# EAGLE design AQ_sensor_GSM (EAGLE 9.6.2)

## Sheet 1 of 2
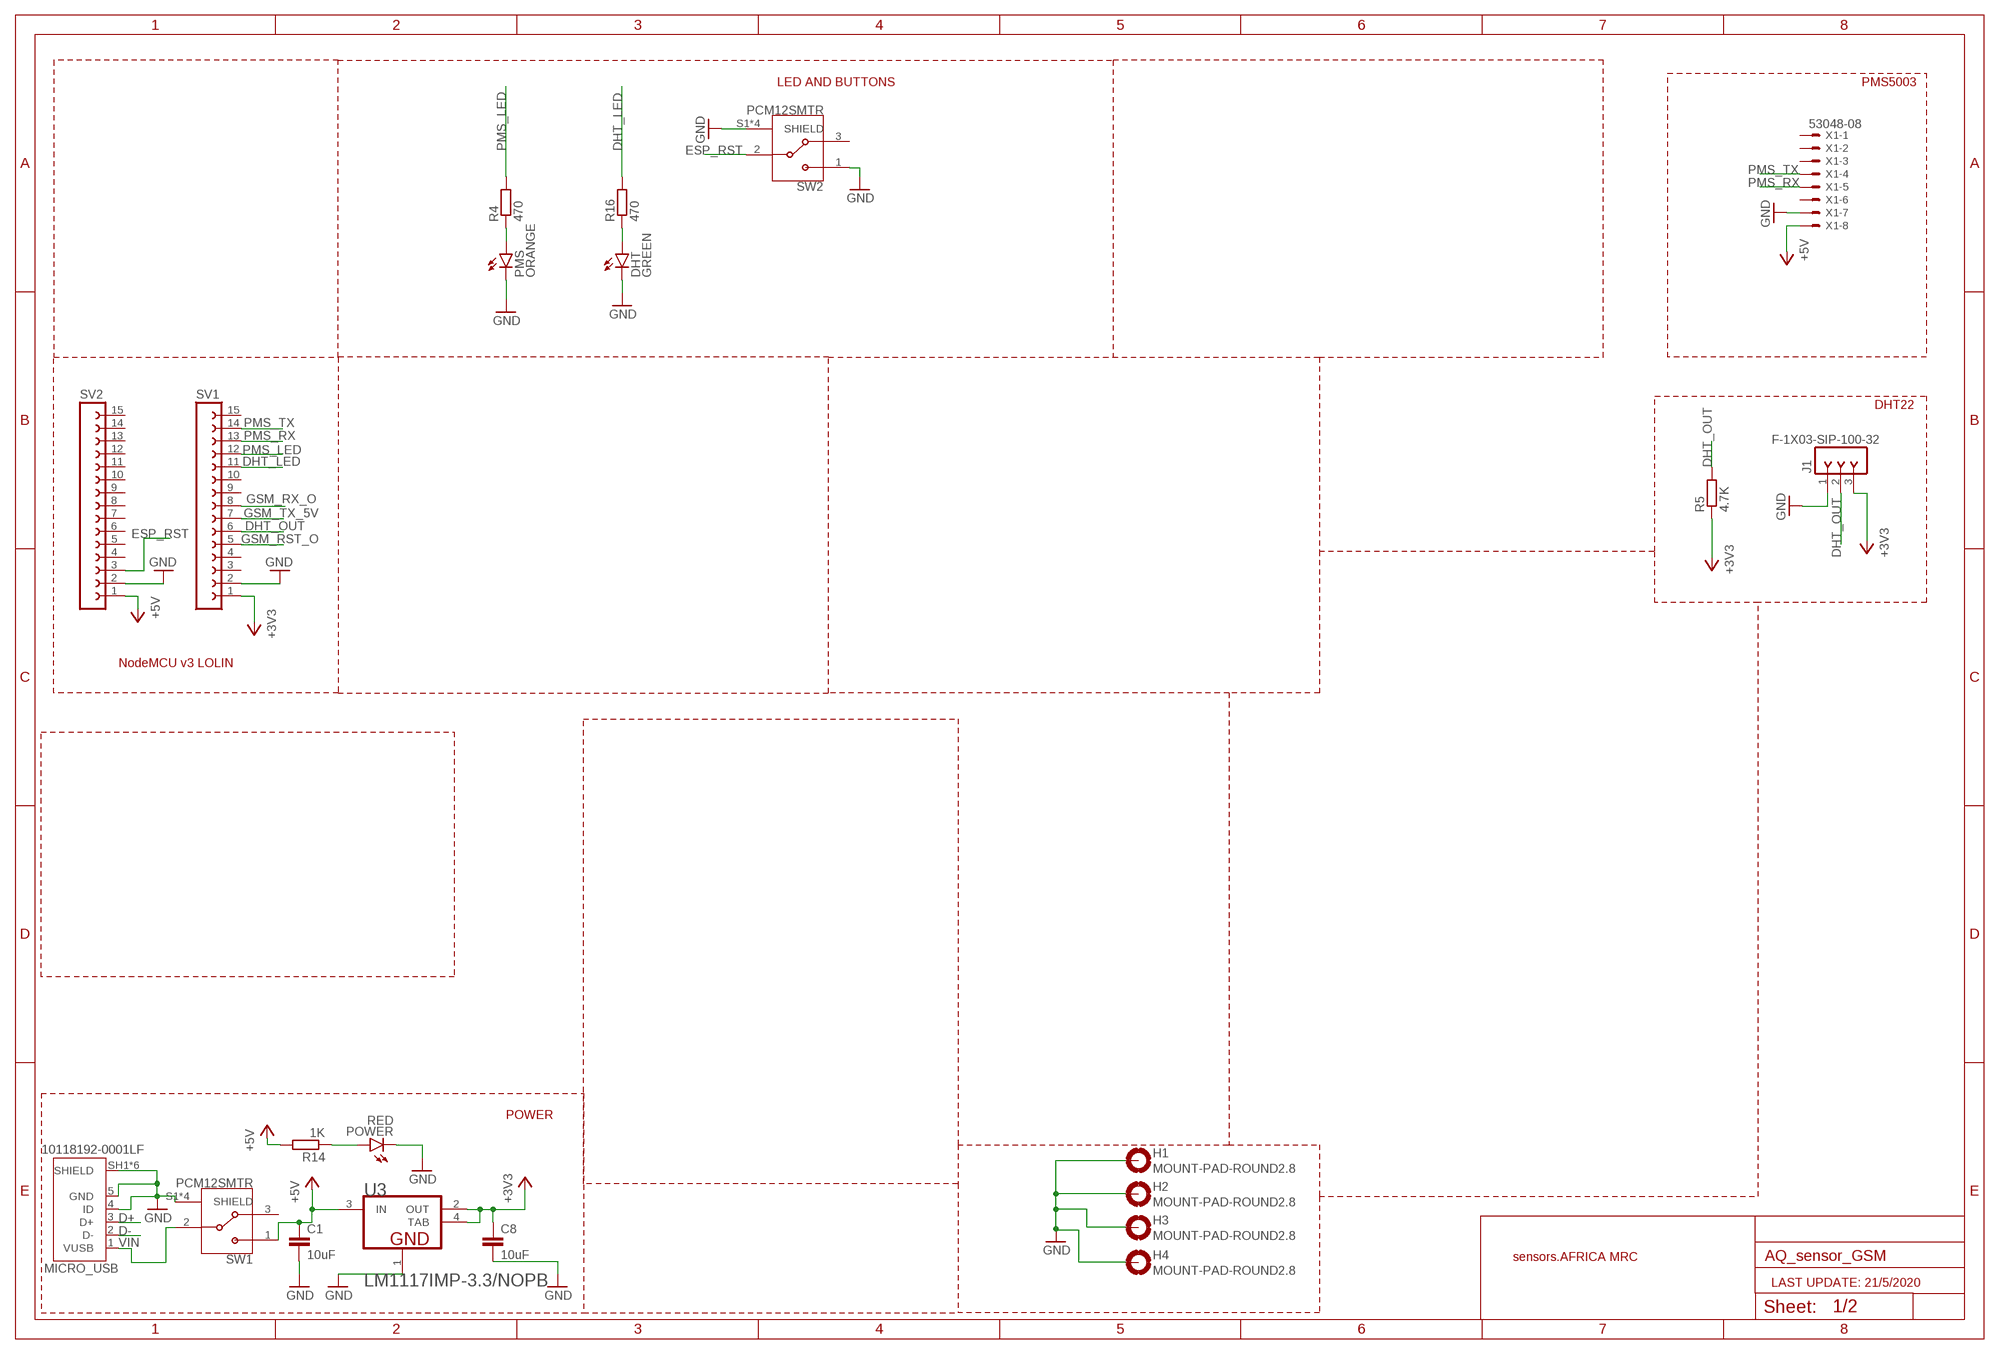
[diagram p0: schematic, sheet 1]

### Parts
C1  10uF  C-EUC0603  [C0603]
C8  10uF  C-EUC0603  [C0603]
DHT  GREEN  LEDCHIP-LED0603  [CHIP-LED0603]
H1  MOUNT-PAD-ROUND2.8  [2,8-PAD]
H2  MOUNT-PAD-ROUND2.8  [2,8-PAD]
H3  MOUNT-PAD-ROUND2.8  [2,8-PAD]
H4  MOUNT-PAD-ROUND2.8  [2,8-PAD]
J1  F-1X03-SIP-100-32  [SIP-100-03-32]
MICRO_USB  10118192-0001LF  [AMPHENOL_10118192-0001LF]
PMS  ORANGE  LEDCHIP-LED0603  [CHIP-LED0603]
POWER  RED  LEDCHIP-LED0603  [CHIP-LED0603]
R4  470  R-EU_R0603  [R0603]
R5  4.7K  R-EU_R0603  [R0603]
R14  1K  R-EU_R0603  [R0603]
R16  470  R-EU_R0603  [R0603]
SV1  FE15-1  [FE15]
SV2  FE15-1  [FE15]
SW1  PCM12SMTR  [SW_PCM12SMTR]
SW2  PCM12SMTR  [SW_PCM12SMTR]
U3  TEXAS_INSTRUMENTS_LM1117IMP-3.3-NOPBTEXAS_INSTRUMENTS_LM1117IMP-3.3-NOPB_0_0  [TEXAS_INSTRUMENTS_LM1117IMP-3.3-NOPB_0]
X1  53048-08  [53048-08]

### Nets
+3V3 [POWER]: C8.1 J1.3 R5.1 SV1.1 U3.2(OUT) U3.4(TAB)
+5V [POWER]: C1.1 R14.2 SV2.1 SW1.1 U3.3(IN) X1.8 ; also sheet 2
D+: MICRO_USB.3(D+)
D-: MICRO_USB.2(D-)
DHT_LED: R16.2 SV1.11
DHT_OUT: J1.2 R5.2 SV1.6
ESP_RST: SV2.3 SW2.2
GND [BGA]: C1.2 C8.2 DHT.C H1.B2,8(MOUNT) H2.B2,8(MOUNT) H3.B2,8(MOUNT) H4.B2,8(MOUNT) J1.1 MICRO_USB.4(ID) MICRO_USB.5(GND) MICRO_USB.SH1(SHIELD) MICRO_USB.SH2(SHIELD) MICRO_USB.SH3(SHIELD) MICRO_USB.SH4(SHIELD) MICRO_USB.SH5(SHIELD) MICRO_USB.SH6(SHIELD) PMS.C POWER.C SV1.2 SV2.2 SW1.S1(SHIELD) SW1.S2(SHIELD) SW1.S3(SHIELD) SW1.S4(SHIELD) SW2.1 SW2.S1(SHIELD) SW2.S2(SHIELD) SW2.S3(SHIELD) SW2.S4(SHIELD) U3.1(GND) X1.7 ; also sheet 2
GSM_RST_O: SV1.5
GSM_RX_O: SV1.8 ; also sheet 2
GSM_TX_5V: SV1.7 ; also sheet 2
N$4: PMS.A R4.1
N$25: POWER.A R14.1
N$27: DHT.A R16.1
PMS_LED: R4.2 SV1.12
PMS_RX: SV1.13 X1.5
PMS_TX: SV1.14 X1.4
VIN: MICRO_USB.1(VUSB) SW1.2
Unconnected: SV1.3 SV1.4 SV1.9 SV1.10 SV1.15 SV2.4 SV2.5 SV2.6 SV2.7 SV2.8 SV2.9 SV2.10 SV2.11 SV2.12 SV2.13 SV2.14 SV2.15 SW1.3 SW2.3 X1.1 X1.2 X1.3 X1.6

### Notes on the sheet
- LED AND BUTTONS | PMS5003
- DHT22
- NodeMCU v3 LOLIN
- POWER
- sensors.AFRICA MRC
- LAST UPDATE: 21/5/2020

## Sheet 2 of 2
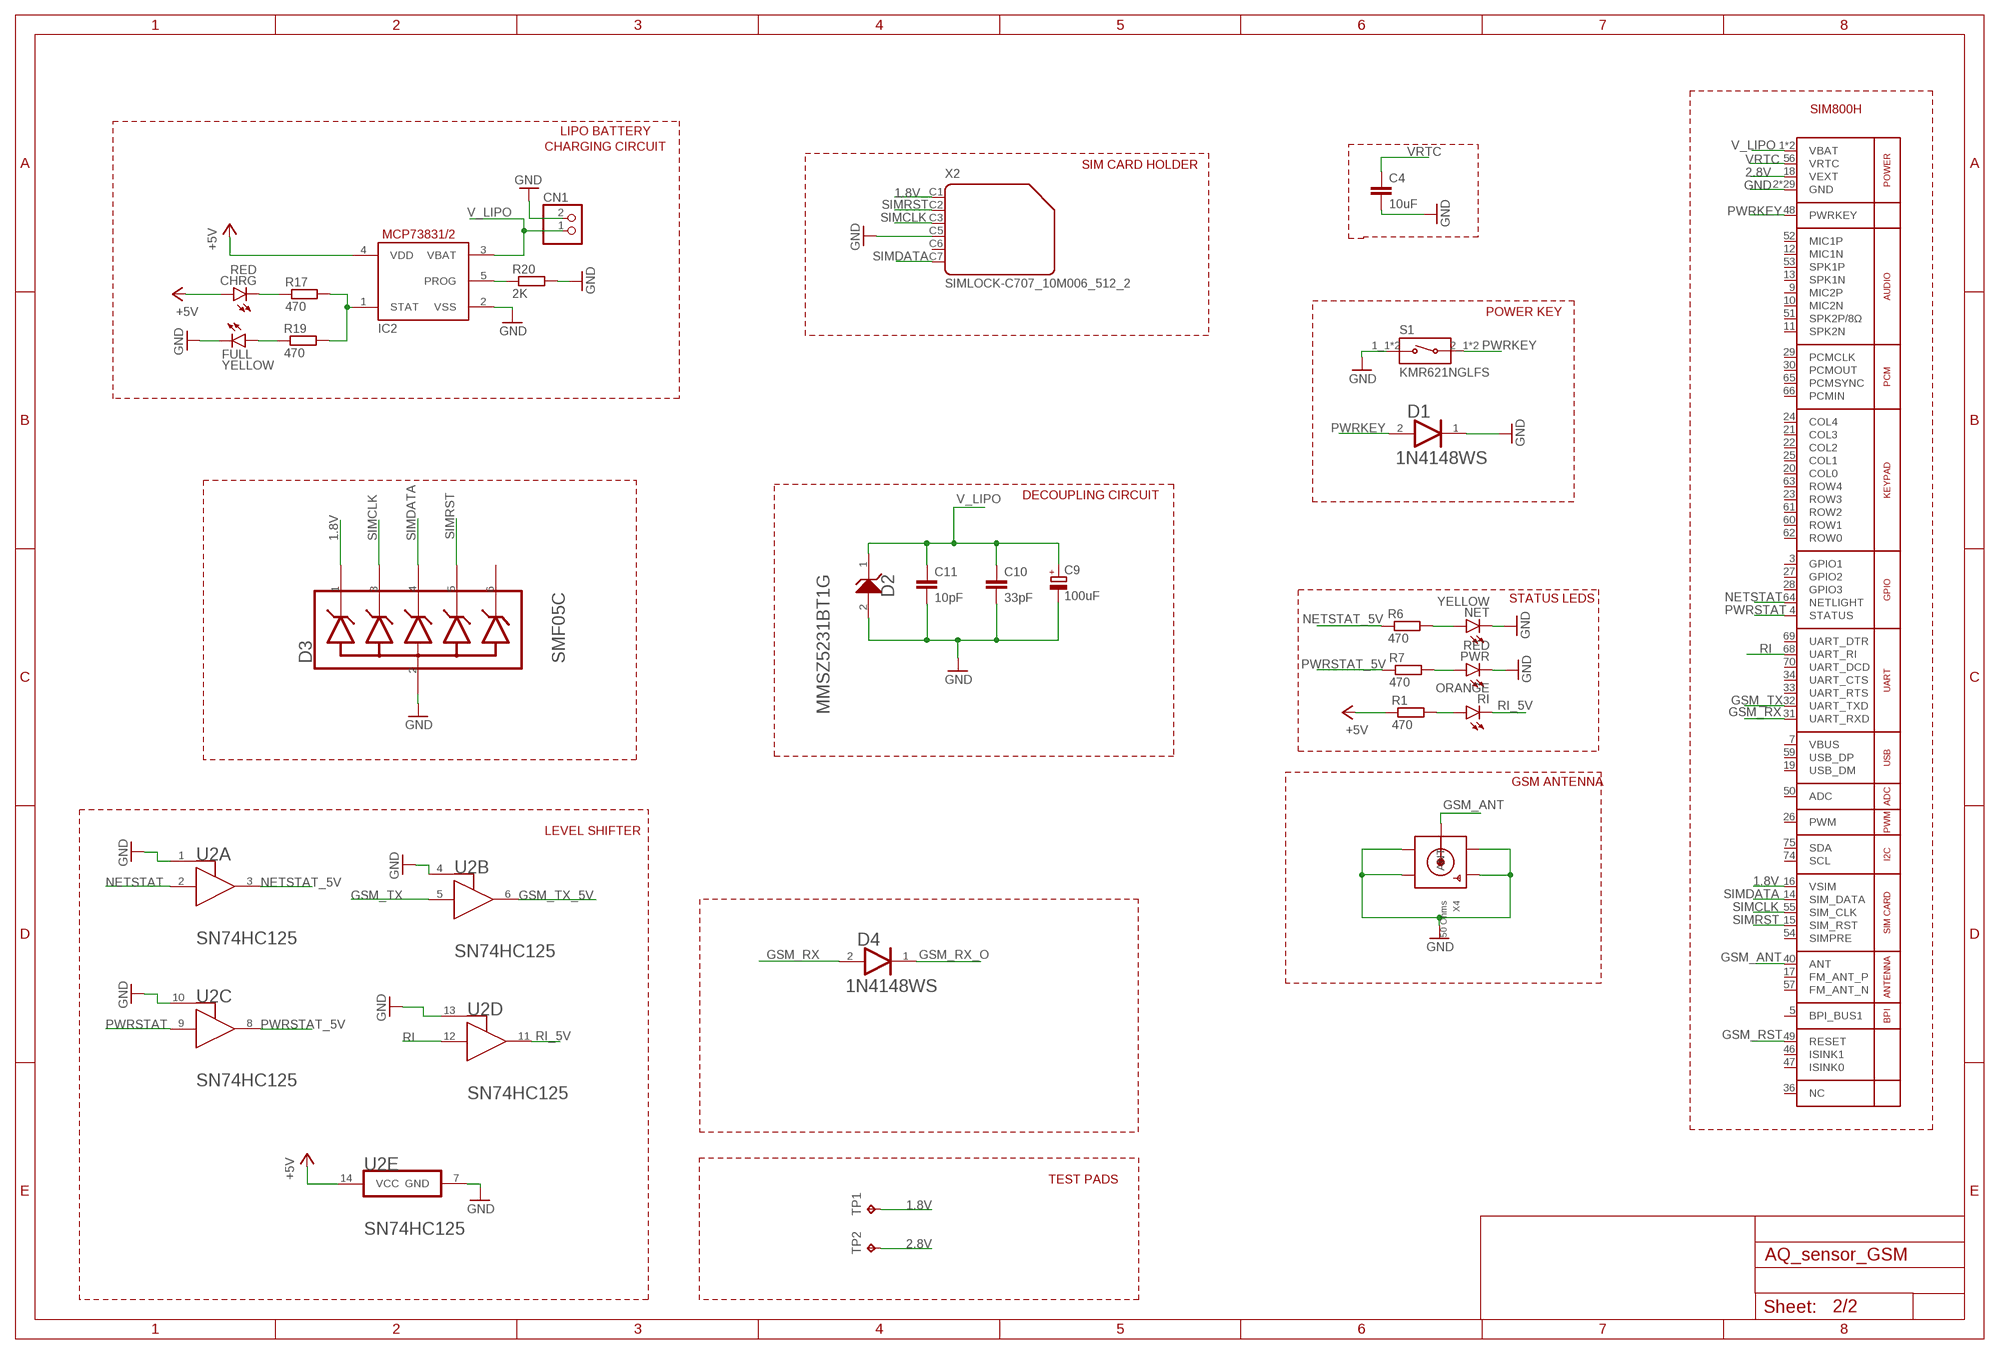
[diagram p1: schematic, sheet 2]

### Parts
C4  10uF  C-EUC0603  [C0603]
C9  100uF  CPOL-EUD  [PANASONIC_D]
C10  33pF  C-EUC0603  [C0603]
C11  10pF  C-EUC0603  [C0603]
CHRG  RED  LEDCHIP-LED0603  [CHIP-LED0603]
CN1  JST_2PIN-SMT-RA  [JST-PH-2-SMT-RA]
D1  ON_SEMI_1N4148WSON_SEMI_1N4148WS_0_0  [ON_SEMI_1N4148WS_0]
D2  ON_SEMICONDUCTOR_MMSZ5231BT1GON_SEMICONDUCTOR_MMSZ5231BT1G_0_0  [ON_SEMICONDUCTOR_MMSZ5231BT1G_0]
D3  SEMTECH_SMF05CSEMTECH_SMF05C_0_0  [SEMTECH_SMF05C_0]
D4  ON_SEMI_1N4148WSON_SEMI_1N4148WS_0_0  [ON_SEMI_1N4148WS_0]
FULL  YELLOW  LEDCHIP-LED0603  [CHIP-LED0603]
IC2  MCP73831/OT  [SOT23-5L]
NET  YELLOW  LEDCHIP-LED0603  [CHIP-LED0603]
PWR  RED  LEDCHIP-LED0603  [CHIP-LED0603]
R1  470  R-EU_R0603  [R0603]
R6  470  R-EU_R0603  [R0603]
R7  470  R-EU_R0603  [R0603]
R17  470  R-EU_R0603  [R0603]
R19  470  R-EU_R0603  [R0603]
R20  2K  R-EU_R0603  [R0603]
RI  ORANGE  LEDCHIP-LED0603  [CHIP-LED0603]
S1  KMR621NGLFS  [SW_KMR621NGLFS]
TP1  TPB1,27  [B1,27]
TP2  TPB1,27  [B1,27]
U1  GSM_SIM800L  [SIM800L]
U2  TEXAS_INSTRUMENTS_SN74HC125TEXAS_INSTRUMENTS_SN74HC125_0_0  [TEXAS_INSTRUMENTS_SN74HC125_0]
X2  SIMLOCK-C707_10M006_512_2  [C707_10M006_512_2]
X4  50 Ohms  SMACONNECTOR_EDGE_UFL  [SMA_EDGELAUNCH_UFL]

### Nets
1.8V: D3.1(1_CATHODE) TP1.TP U1.16(VSIM) X2.C1
2.8V: TP2.TP U1.18(VEXT)
+5V [POWER]: CHRG.A IC2.4(VDD) R1.1 U2.14(E:VCC) ; also sheet 1
GND [BGA]: C4.2 C9.- C10.2 C11.2 CN1.2 D1.1(CATHODE) D2.2(A) D3.2(ANODE) FULL.C IC2.2(VSS) NET.C PWR.C R20.2 S1.1_1 S1.1_2 U1.2(GND) U1.6(GND) U1.8(GND) U1.35(GND) U1.37(GND) U1.38(GND) U1.39(GND) U1.41(GND) U1.43(GND) U1.44(GND) U1.45(GND) U1.58(GND) U1.67(GND) U1.71(GND) U1.72(GND) U1.73(GND) U1.76(GND) U1.77(GND) U1.78(GND) U1.79(GND) U1.80(GND) U1.81(GND) U1.82(GND) U1.83(GND) U1.84(GND) U1.85(GND) U1.86(GND) U1.87(GND) U1.88(GND) U2.1(A:1_!OE!) U2.4(B:4_!OE!) U2.7(E:GND) U2.10(C:2_!OE!) U2.13(D:3_!OE!) X2.C5 X4.GND@1(GND1) X4.GND@2(GND2) X4.GND@3(GND3) X4.GND@4(GND4) ; also sheet 1
GSM_ANT: U1.40(ANT) X4.P(ANT)
GSM_RST [BGA]: U1.49(RESET)
GSM_RX: D4.2(ANODE) U1.31(UART_RXD)
GSM_RX_O: D4.1(CATHODE) ; also sheet 1
GSM_TX: U1.32(UART_TXD) U2.5(B:2A)
GSM_TX_5V: U2.6(B:2Y) ; also sheet 1
N$6: CHRG.C R17.1
N$9: IC2.1(STAT) R17.2 R19.2
N$10: NET.A R6.2
N$11: PWR.A R7.2
N$12: FULL.A R19.1
N$13: IC2.5(PROG) R20.1
N$14: R1.2 RI.A
NETSTAT [BGA]: U1.64(NETLIGHT) U2.2(A:1A)
NETSTAT_5V: R6.1 U2.3(A:1Y)
PWRKEY [BGA]: D1.2(ANODE) S1.2_1 S1.2_2 U1.48(PWRKEY)
PWRSTAT: U1.4(STATUS) U2.9(C:3A)
PWRSTAT_5V: R7.1 U2.8(C:3Y)
RI [BGA]: U1.68(UART_RI) U2.12(D:4A)
RI_5V: RI.C U2.11(D:4Y)
SIMCLK [BGA]: D3.3(2_CATHODE) U1.55(SIM_CLK) X2.C3
SIMDATA: D3.4(3_CATHODE) U1.14(SIM_DATA) X2.C7
SIMRST: D3.5(4_CATHODE) U1.15(SIM_RST) X2.C2
V_LIPO: C9.+ C10.1 C11.1 CN1.1 D2.1(K) IC2.3(VBAT) U1.1(VBAT) U1.42(VBAT)
VRTC [BGA]: C4.1 U1.56(VRTC)
Unconnected: D3.6(5_CATHODE) U1.3(GPIO1) U1.5(BPI_BUS1) U1.9(MIC2P) U1.10(MIC2N) U1.11(SPK2N) U1.12(MIC1N) U1.13(SPK1N) U1.17(FM_ANT_P) U1.19(USB_DM) U1.20(COL0) U1.21(COL3) U1.22(COL2) U1.23(ROW3) U1.24(COL4) U1.25(COL1) U1.26(PWM) U1.27(GPIO2) U1.28(GPIO3) U1.29(PCMCLK) U1.30(PCMOUT) U1.33(UART_RTS) U1.34(UART_CTS) U1.36(NC) U1.46(ISINK1) U1.47(ISINK0) U1.50(ADC) U1.51(SPK2P/8Ω) U1.52(MIC1P) U1.53(SPK1P) U1.54(SIMPRE) U1.57(FM_ANT_N) U1.59(USB_DP) U1.60(ROW1) U1.61(ROW2) U1.62(ROW0) U1.63(ROW4) U1.65(PCMSYNC) U1.66(PCMIN) U1.69(UART_DTR) U1.70(UART_DCD) U1.74(SCL) U1.75(SDA) X2.C6

### Notes on the sheet
- SIM800H
- LIPO BATTERY
- CHARGING CIRCUIT
- SIM CARD HOLDER
- POWER KEY
- DECOUPLING CIRCUIT
- STATUS LEDS
- GSM ANTENNA
- LEVEL SHIFTER
- TEST PADS

## Power pins joined to a net without a drawn wire
VBUS: U1.7(VBUS)

## Library data of the parts
C1 C4 C8 C10 C11 = rcl:C-EU: CAPACITOR, European symbol; SPICEPREFIX: C
C9 = rcl:CPOL-EU: POLARIZED CAPACITOR, European symbol; SPICEPREFIX: C
CHRG DHT FULL NET PMS POWER PWR RI = led:LED: LED OSRAM: - CHIPLED LG R971, LG N971, LY N971, LG Q971, LY Q971, LO R971, LY R971 LH N974, LH R974 LS Q976, LO Q976, LY Q976 LO Q996 - Hyper CHIPLED LW Q18S LB Q993, LB Q99A, LB R99A - SideLED LS A670, LO A670, LY A670, LG A670, LP A670 LB A673, LV A673, LT A673, LW A673 LH A674 LY A675 LS A676, LA A676, LO A676, LY A676, LW A676 LS A679, LY A679, LG A679 - Hyper Micro SIDELED® LS Y876, LA Y876, LO Y876, LY Y876 LT Y87S - SmartLED LW L88C, LW L88S LB L89C, LB L89S, LG L890 LS L89K, LO L89K, LY L89K LS L896, LA L896, LO L896, LY L896 - TOPLED LS T670, LO T670, LY T670, LG T670, LP T670 LSG T670, LSP T670, LSY T670, LOP T670, LYG T670 LG T671, LOG T671, LSG T671 LB T673, LV T673, LT T673, LW T673 LH T674 LS T676, LA T676, LO T676, LY T676, LB T676, LH T676, LSB T676, LW T676 LB T67C, LV T67C, LT T67C, LS T67K, LO T67K, LY T67K, LW E67C LS E67B, LA E67B, LO E67B, LY E67B, LB E67C, LV E67C, LT E67C LW T67C LS T679, LY T679, LG T679 LS T770, LO T770, LY T770, LG T770, LP T770 LB T773, LV T773, LT T773, LW T773 LH T774 LS E675, LA E675, LY E675, LS T675 LS T776, LA T776, LO T776, LY T776, LB T776 LHGB T686 LT T68C, LB T68C - Hyper Mini TOPLED® LB M676 - Mini TOPLED Santana® LG M470 LS M47K, LO M47K, LY M47K Source: http://www.osram.convergy.de LUXEON: - LUMILED® LXK2-PW12-R00, LXK2-PW12-S00, LXK2-PW14-U00, LXK2-PW14-V00 LXK2-PM12-R00, LXK2-PM12-S00, LXK2-PM14-U00 LXK2-PE12-Q00, LXK2-PE12-R00, LXK2-PE12-S00, LXK2-PE14-T00, LXK2-PE14-U00 LXK2-PB12-K00, LXK2-PB12-L00, LXK2-PB12-M00, LXK2-PB14-N00, LXK2-PB14-P00, LXK2-PB14-Q00 LXK2-PR12-L00, LXK2-PR12-M00, LXK2-PR14-Q00, LXK2-PR14-R00 LXK2-PD12-Q00, LXK2-PD12-R00, LXK2-PD12-S00 LXK2-PH12-R00, LXK2-PH12-S00 LXK2-PL12-P00, LXK2-PL12-Q00, LXK2-PL12-R00 Source: www.luxeon.com KINGBRIGHT: KA-3528ASYC Source: www.kingbright.com
CN1 = AQ_sensor_GSM:JST_2PIN: JST 2-Pin Connectors of various flavors SMT-RA (S2B-PH-SM4) 4UConnector #17311 SMT (B2B-PH-SM4) THM-RA (S2B-PH) THM (B2B-PH)
D1 D4 = AQ_sensor_GSM:ON_SEMI_1N4148WS: Small Signal Diodes; CENTROID_NOT_SPECIFIED: No; DATASHEET: https://www.fairchildsemi.com/datasheets/1N/1N4148WS.pdf; DIGIKEY_DESCRIPTION: DIODE GEN PURP 75V 150MA SOD323F; DIGIKEY_PART_NUMBER: 1N4148WSFSCT-ND; IPC_LAND_PATTERN_NAME: SOD250125X70-2; LEAD_FREE: yes; MF: ON Semi; MFG_PACKAGE_IDENT: CASE 477AB; MOUSER_DESCRIPTION: Diodes - General Purpose, Power, Switching Small Signal Diode; MOUSER_PART_NUMBER: 512-1N4148WS; MPN: 1N4148WS; PACKAGE: SOD-323FL; PREFIX: D; ROHS: yes; TEMPERATURE_RANGE_HIGH: +150°C
D2 = AQ_sensor_GSM:ON_SEMICONDUCTOR_MMSZ5231BT1G: ONSC-K1A2-2; CIIVA_IDS: 804101; COMPONENT_LINK_1_DESCRIPTION: Manufacturer URL; COMPONENT_LINK_1_URL: http://www.onsemi.com/; COMPONENT_LINK_3_DESCRIPTION: Package Specification; COMPONENT_LINK_3_URL: http://www.onsemi.com/pub_link/Collateral/425-04.PDF; DATASHEET: http://www.onsemi.com/pub_link/Collateral/MMSZ5221BT1-D.PDF; DATASHEET_VERSION: Rev. 12; FOOTPRINT_VARIANT_NAME_0: Manufacturer Recommended; IMPORTED: yes; IMPORTED_FROM: vault; IMPORT_TS: 1521844429; MF: On Semiconductor; MOUNTING_TECHNOLOGY: Surface Mount; MPN: MMSZ5231BT1G; PACKAGE: SOD-123-2-425-04; PACKAGE_DESCRIPTION: 2-Pin SOD, Body 1.6 x 2.69 mm; PACKAGE_VERSION: Rev. G, 10/2009; PACKING: Tape and Reel; PREFIX: D; P_MAX_W: 0.5; RELEASE_DATE: 1407150685; ROHS: No; VAULT_GUID: 27F6BF34-1EB2-4973-A1B4-1410F52D084D; VAULT_REVISION: BBBB861B-93F7-43FE-93E6-D586C34E6C45; VZ_TYP_V: 5.1
D3 = AQ_sensor_GSM:SEMTECH_SMF05C: TVS Diode Array; CENTROID_NOT_SPECIFIED: No; DATASHEET: http://www.semtech.com/images/datasheet/smf05c.pdf; DIGIKEY_DESCRIPTION: DIODE TVS DIODE 5VWM 12.5VC SC70-6; DIGIKEY_PART_NUMBER: SMF05CCT-ND; JUNCTION_CAPACITANCE: 130pF max; LEAD_FREE: yes; MANUFACTURER_PRODUCT_PAGE: http://www.semtech.com/apps/product.php?pn=SMF05C; MF: Semtech; MFG_PACKAGE_IDENT: SC70-6L; MOUSER_PART_NUMBER: 947-SMF05C.TCT; MPN: SMF05C; PACKAGE: SC-70-6; PREFIX: D; REVERSE_STAND-OFF_VOLTAGE: 5V; ROHS: yes; TEMPERATURE_RANGE_HIGH: +125°C; TEMPERATURE_RANGE_LOW: -55°C
H1-H4 = AQ_sensor_GSM:MOUNT-PAD-ROUND: MOUNTING PAD, round
IC2 = AQ_sensor_GSM:MCP73831: MCP73831/2 Miniature Single-Cell, Fully Integrated Li-Ion, Li-Polymer Charge Management Controllers. Nice and small simple lipoly charge controller, with adjustable current and status output (LED) http://www.ladyada.net/library/pcb/eaglelibrary.html
J1 = AQ_sensor_GSM:F-1X03-: FEMALE HEADER
MICRO_USB = AQ_sensor_GSM:10118192-0001LF: Single Port 5 Contact Horizontal Right Angle Shielded Micro B USB 2.0 Connector; AVAILABILITY: Unavailable; DESCRIPTION: USB - micro B USB 2.0 Receptacle Connector 5 Position Surface Mount, Right Angle; MF: Amphenol ICC; MP: 10118192-0001LF; PACKAGE: None; PRICE: None
R1 R4-R7 R14 R16 R17 R19 R20 = rcl:R-EU_: RESISTOR, European symbol; SPICEPREFIX: R
S1 = AQ_sensor_GSM:KMR621NGLFS: Tactile Switches 50mA 32VDC 1.9mmH 2N IP67; AVAILABILITY: Unavailable; DESCRIPTION: Tactile Switch SPST-NO Top Actuated Surface Mount; MF: C&K; MP: KMR621NG LFS; PACKAGE: None; PRICE: None
SV1 SV2 = AQ_sensor_GSM:FE15-1: FEMALE HEADER; OC_FARNELL: unknown; OC_NEWARK: unknown
SW1 SW2 = AQ_sensor_GSM:PCM12SMTR: Switch Slide ON ON SPDT Side Slide 0.3A 6VDC 10000Cycles Gull Wing SMD T/R; AVAILABILITY: Unavailable; DESCRIPTION: Slide Switch SPDT Surface Mount, Right Angle; MF: C&K; MP: PCM12SMTR; PACKAGE: DO-201 C&amp;K Components; PRICE: None
TP1 TP2 = testpad:TP: Test pad
U1 = AQ_sensor_GSM:GSM_SIM800L: SIM800K Quad-Band GSM/GPRS Module 850/900/1800/1900 MHz Bluetooth EDR (3.0) FM Band: 76-109MHz (50kHz steps) -40 - 85°C
U2 = AQ_sensor_GSM:TEXAS_INSTRUMENTS_SN74HC125: TI-SN74HC125-D0014A-14; BITS: 4; CIIVA_IDS: 1347642; CODE__JEDEC: MS-012; DATASHEET_VERSION: SCLS104D; FOOTPRINT_VARIANT_NAME_0: Level C; FOOTPRINT_VARIANT_NAME_1: Level B; FOOTPRINT_VARIANT_NAME_2: Level A; F__NOM_VOLTAGEMAXMHZ: 28; ICC__NOM_VOLTAGEMAXMA: 0.16; IMPORTED: yes; IMPORTED_FROM: vault; IMPORT_TS: 1521847871; INPUT_TYPE: CMOS; MF: Texas Instruments; MPN: SN74HC125; OPERATING_TEMPERATURE_RANGEC: -40 to 85; OUTPUT_TYPE: CMOS; PACKAGE: D0014A; PACKAGE_VERSION: http://www.ti.com/lit/ml/mpds177g/mpds177g.pdf; PIN_0_0_0_OUTSIDE_EDGE: dot; PIN_0_1_0_OUTSIDE_EDGE: dot; PIN_0_2_0_OUTSIDE_EDGE: dot; PIN_0_3_2_OUTSIDE_EDGE: dot; PREFIX: U; RATING: Catalog; RELEASE_DATE: 1459237643; TPD__NOM_VOLTAGEMAXNS: 26; VAULT_GUID: 3C6FD517-640E-4127-B90A-BA192E753297; VAULT_REVISION: 33E4D10A-39F8-41E5-8A10-D32CFAC933D3; VCC_MAX_V: 6; VCC_MIN_V: 2; VOLTAGE_NOM_V: 6
U3 = AQ_sensor_GSM:TEXAS_INSTRUMENTS_LM1117IMP-3.3-NOPB: PM-REG-LM1086-SOT4; CIIVA_IDS: 19361124; CODE__IPC: SOT223-4; CODE__JEDEC: TO-261-AA; COMPONENT_LINK_1_DESCRIPTION: Datasheet URL; COMPONENT_LINK_1_URL: http://www.ti.com/general/docs/lit/getliterature.tsp?genericPartNumber=LM1117-N&fileType=pdf; COMP_TYPE: LDO IC; FOOTPRINT_VARIANT_NAME_0: Level C; FOOTPRINT_VARIANT_NAME_1: Level B; FOOTPRINT_VARIANT_NAME_2: Level A; HIGH__RELIABILITY: Y; IMPORTED: yes; IMPORTED_FROM: vault; IMPORT_TS: 1521845365; MF: Texas Instruments; MPN: LM1117IMP-3.3/NOPB; PACKAGE: DCY0004A; PACKAGE_DESCRIPTION: Molded SOT-223, 6.50 x 3.56 x 1.6mm Body, 4 Lead, 2.3mm Pitch; PACKAGE_TOP_MARKING: XYTT*N05B; PIN_COUNT: 4; POWER_WISE: N; PREFIX: U; RELEASE_DATE: 1464077430; ROHS: Yes; VAULT_GUID: 7E820BF6-F141-44C1-8A74-392CB201F257; VAULT_REVISION: 16019014-2FBF-4157-ADF5-B132B4DC413A
X1 = AQ_sensor_GSM:53?-08: CONNECTOR wire to board 1.25 mm (.049 inch) pitch header; MF: WALDOM/MOLEX; MPN: 53048-0810; OC_FARNELL: 9733094; OC_NEWARK: 38C9913
X2 = AQ_sensor_GSM:SIMLOCK-C707_10M006_512_2: C707A SIMLOCK® 2.5 mm with wide solder tails Source: Data sheet <http://www.amphenol.info/downloads/C707_10M006_512_2.pdf>; OC_FARNELL: unknown; OC_NEWARK: unknown
X4 = AQ_sensor_GSM:SMACONNECTOR: SMA Connector 90° DIP SMA Connector, 50 Ohm (4UConnector: 07259)

## Net classes
0 default: width 0.3 mm, drill 0.3 mm, clearance 0.2 mm
1 POWER: width 0.4 mm, drill 0.3 mm, clearance 0.2 mm to class 0, clearance 0.2 mm

## Board
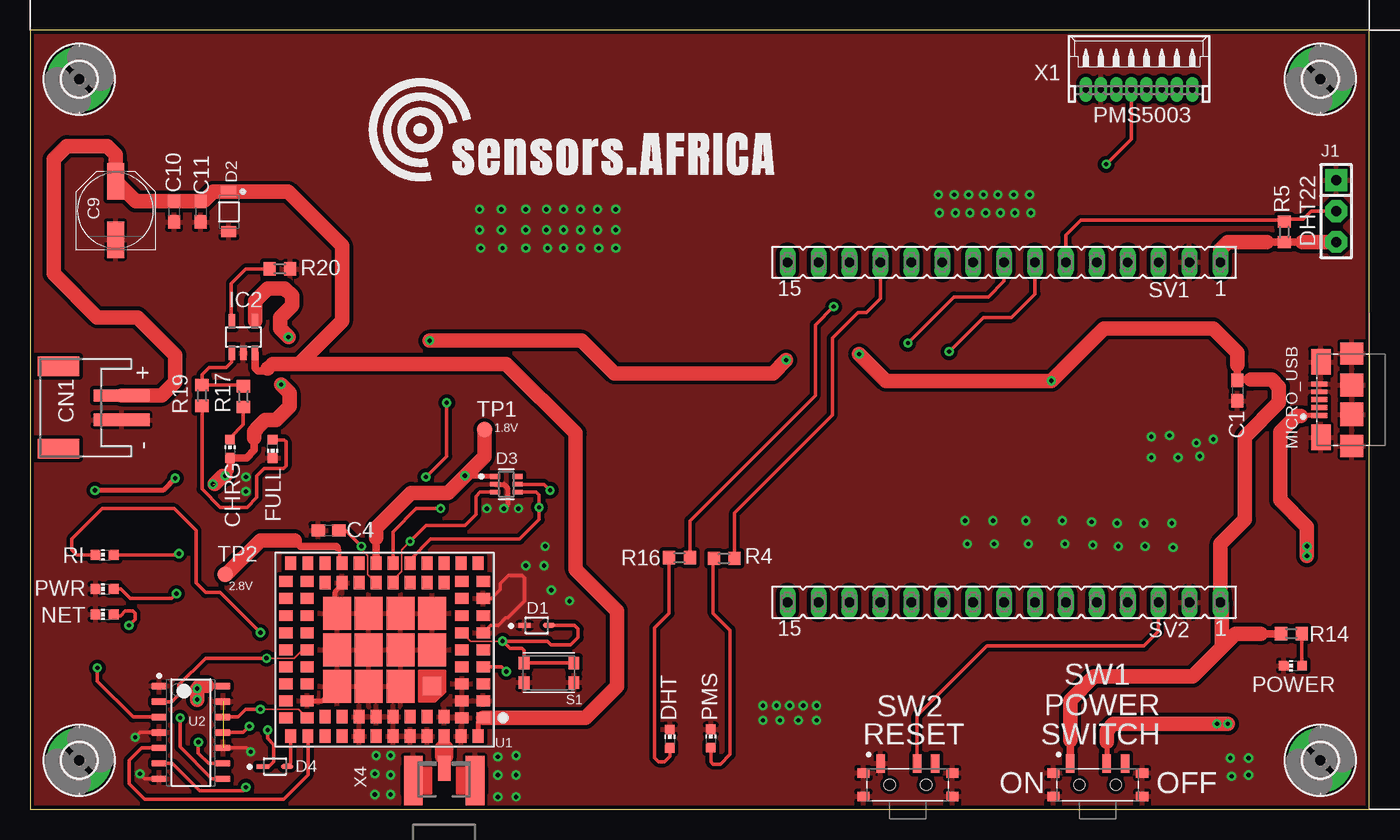
[diagram p2: board, top side]
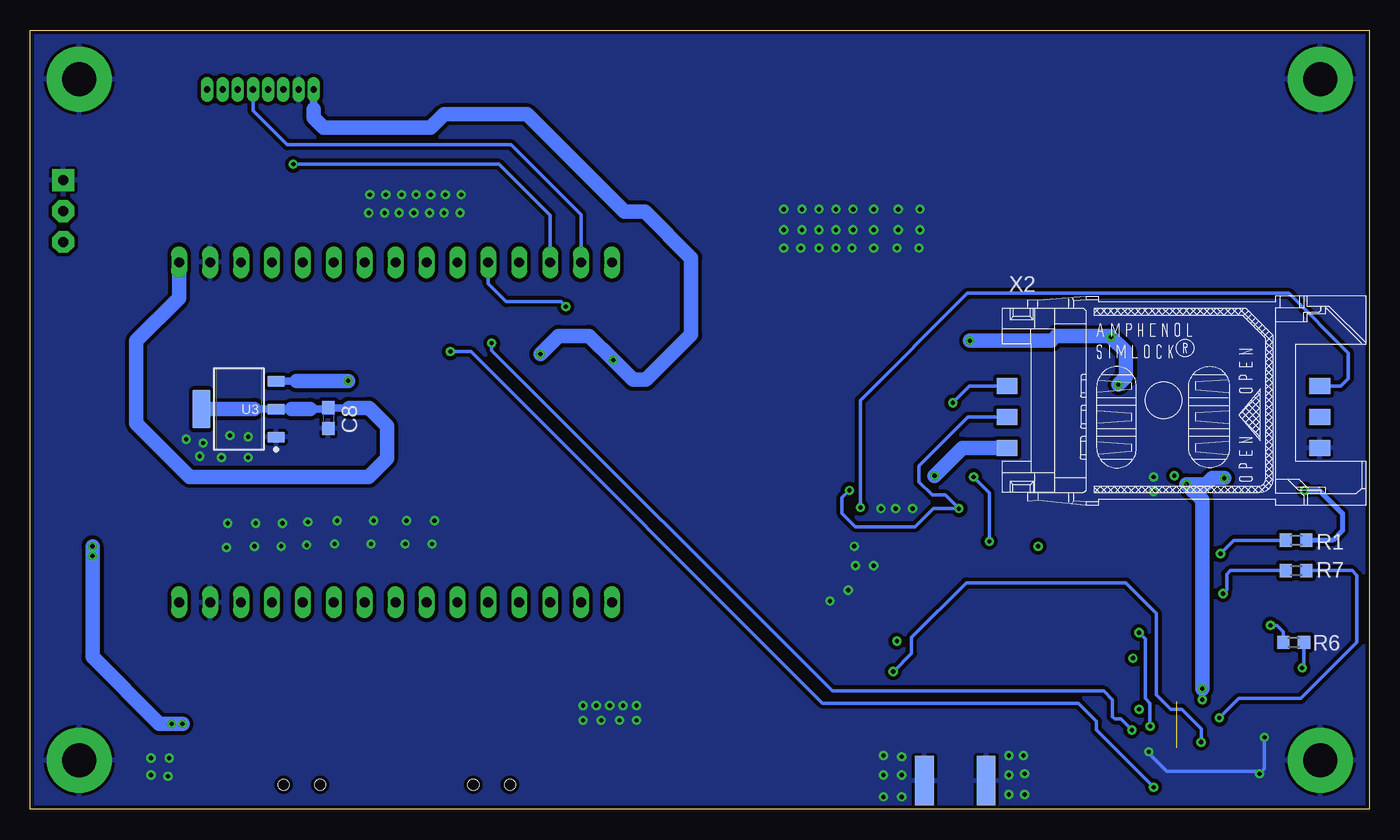
[diagram p3: board, bottom side, seen from below]

Size 110 x 64 mm. Coordinates in mm from the lower left corner, seen from the top.
Outline: 0,0 110,0 110,64 0,64 0,0
Copper layers (1*16): Top 0.035mm / dielectric 1.5mm / Bottom 0.035mm
Design rules "default *": minimum track width 0.1mm, minimum drill 0.15mm, track to track 0.3mm, track to pad 0.1mm, pad to pad 0.2mm, via to via 0.3mm, smd to smd 0.3mm, copper to edge 0.3mm, drill to drill 0.3mm, minimum pad ring 10mil, minimum via ring 8mil, stop-mask expansion 4mil, vias tented up to drill 0mil, thermal gap 10mil

### Footprints (pad centres in the part's own frame; a part is rotated, then mirrored left to right if it is on the bottom)
C0603 = smd 1.1 x 1: 1 -0.85,0; 2 0.85,0
PANASONIC_D = smd 3 x 1.4: + 2.4,0; - -2.4,0
CHIP-LED0603 = smd 0.8 x 0.8: A 0,-0.75; C 0,0.75
JST-PH-2-SMT-RA = smd 1 x 4.6: 1 1,-3.7; 2 -1,-3.7 | smd 1.6 x 3.4: NC1 -3.4,1.5; NC2 3.4,1.5
ON_SEMI_1N4148WS_0 = smd 1.006 x 0.392: 1 -1,0; 2 1,0
ON_SEMICONDUCTOR_MMSZ5231BT1G_0 = smd 0.91 x 1.22: 1 -1.635,0; 2 1.635,0
SEMTECH_SMF05C_0 = smd 0.85 x 0.4: 1 -0.925,0.65; 2 -0.925,0; 3 -0.925,-0.65; 4 0.925,-0.65; 5 0.925,0; 6 0.925,0.65
2,8-PAD = drill 2.8 pad 5.334: B2,8 0,0
SOT23-5L = smd 0.55 x 1.2: 1 -0.95,-1.3; 2 0,-1.3; 3 0.95,-1.3; 4 0.95,1.3; 5 -0.95,1.3
SIP-100-03-32 = drill 0.813 pad 1.778 square: 1 -2.54,0 | drill 0.813 pad 1.778 octagon: 2 0,0; 3 2.54,0
AMPHENOL_10118192-0001LF = smd 0.4 x 1.35: 1 -1.3,0; 2 -0.65,0; 3 0,0; 4 0.65,0; 5 1.3,0 | smd 2.1 x 1.6: SH1 -3.1,-0.125; SH2 3.1,-0.125 | smd 1.8 x 1.9: SH3 -3.8,-2.675; SH6 3.8,-2.675 | smd 1.9 x 1.9: SH4 -1.2,-2.675; SH5 1.2,-2.675
R0603 = smd 1 x 1.1: 1 -0.85,0; 2 0.85,0
SW_KMR621NGLFS = smd 0.9 x 1: 1_1 -2.05,0.8; 1_2 2.05,0.8; 2_1 -2.05,-0.8; 2_2 2.05,-0.8
FE15 = drill 0.813 long: 1 -17.78,0; 2 -15.24,0; 3 -12.7,0; 4 -10.16,0; 5 -7.62,0; 6 -5.08,0; 7 -2.54,0; 8 0,0; 9 2.54,0; 10 5.08,0; 11 7.62,0; 12 10.16,0; 13 12.7,0; 14 15.24,0; 15 17.78,0
SW_PCM12SMTR = smd 0.7 x 1.5: 1 -2.25,1.75; 2 0.75,1.75; 3 2.25,1.75 | smd 1 x 0.8: S1 -3.65,0.965; S2 -3.65,-0.965; S3 3.65,-0.965; S4 3.65,0.965 | hole 0.9: -1.5,0; 1.5,0
B1,27 = smd 1.27 x 1.27: TP 0,0
SIM800L = smd 1.1 x 0.9: 1 -8.1,5.6; 2 -8.1,4.2; 3 -8.1,2.8; 4 -8.1,1.4; 5 -8.1,0; 6 -8.1,-1.4; 7 -8.1,-2.8; 8 -8.1,-4.2; 9 -8.1,-5.6; 22 8.1,-5.6; 23 8.1,-4.2; 24 8.1,-2.8; 25 8.1,-1.4; 26 8.1,0; 27 8.1,1.4; 28 8.1,2.8; 29 8.1,4.2; 30 8.1,5.6; 43 -6.36,5.6; 44 -6.36,4.2; 45 -6.36,2.8; 46 -6.36,1.4; 47 -6.36,0; 48 -6.36,-1.4; 49 -6.36,-2.8; 50 -6.36,-4.2; 51 -6.36,-5.6; 60 6.36,-5.6; 61 6.36,-4.2; 62 6.36,-2.8; 63 6.36,-1.4; 64 6.36,0; 65 6.36,1.4; 66 6.36,2.8; 67 6.36,4.2; 68 6.36,5.6 | smd 0.9 x 1.1: 10 -7.7,-7.1; 11 -6.3,-7.1; 12 -4.9,-7.1; 13 -3.5,-7.1; 14 -2.1,-7.1; 15 -0.7,-7.1; 16 0.7,-7.1; 17 2.1,-7.1; 18 3.5,-7.1; 19 4.9,-7.1; 20 6.3,-7.1; 21 7.7,-7.1; 31 7.7,7.1; 32 6.3,7.1; 33 4.9,7.1; 34 3.5,7.1; 35 2.1,7.1; 36 0.7,7.1; 37 -0.7,7.1; 38 -2.1,7.1; 39 -3.5,7.1; 40 -4.9,7.1; 41 -6.3,7.1; 42 -7.7,7.1; 52 -4.9,-5.5; 53 -3.5,-5.5; 54 -2.1,-5.5; 55 -0.7,-5.5; 56 0.7,-5.5; 57 2.1,-5.5; 58 3.5,-5.5; 59 4.9,-5.5; 69 4.9,5.5; 70 3.5,5.5; 71 2.1,5.5; 72 0.7,5.5; 73 -0.7,5.5; 74 -2.1,5.5; 75 -3.5,5.5; 76 -4.9,5.5 | smd 1.5 x 1.5: 77 -3.9,3 | smd 2.3 x 2.7: 78 -3.9,0; 79 -3.9,-3; 80 -1.3,-3; 81 1.3,-3; 82 3.9,-3; 83 3.9,0; 84 3.9,3; 85 1.3,3; 86 -1.3,3; 87 -1.3,0; 88 1.3,0
TEXAS_INSTRUMENTS_SN74HC125_0 = smd 1.25 x 0.55: 1 -2.625,3.81; 2 -2.625,2.54; 3 -2.625,1.27; 4 -2.625,0; 5 -2.625,-1.27; 6 -2.625,-2.54; 7 -2.625,-3.81; 8 2.625,-3.81; 9 2.625,-2.54; 10 2.625,-1.27; 11 2.625,0; 12 2.625,1.27; 13 2.625,2.54; 14 2.625,3.81
TEXAS_INSTRUMENTS_LM1117IMP-3.3-NOPB_0 = smd 1.45 x 0.9: 1 -3.075,2.3; 2 -3.075,0; 3 -3.075,-2.3 | smd 1.45 x 3.15: 4 3.075,0
53048-08 = drill 0.5 pad 0.698 long: 1 4.375,-1.25; 2 3.125,-1.25; 3 1.875,-1.25; 4 0.625,-1.25; 5 -0.625,-1.25; 6 -1.875,-1.25; 7 -3.125,-1.25; 8 -4.375,-1.25
C707_10M006_512_2 = smd 1.7 x 1.3: C1 -12.85,-3.915; C2 -12.85,-1.375; C3 -12.85,1.165; C5 12.85,-3.915; C6 12.85,-1.375; C7 12.85,1.165
SMA_EDGELAUNCH_UFL = smd 4.064 x 1.524: GND@1 2.032,-2.54; GND@2 2.032,2.54 | smd 4.064 x 1.524 bottom: GND@3 2.032,2.54; GND@4 2.032,-2.54 | smd 2.032 x 1.016: P 3.048,0

### Placement (x,y rotation side)
C1  99.18,34.4 270 top
C4  24.5,22.9 180 top
C8  85.52,32.13 270 bottom
C9  7,49.2 90 top
C10  11.8,49.1 270 top
C11  14,49.1 270 top
CHRG  16.4,29.6 0 top
CN1  3.8,33 90 top
D1  41.6,15.1 0 top
D2  16.3,49.1 270 top
D3  39.1,26.7 0 top
D4  20.1,3.5 0 top
DHT  52.54,5.79 0 top
FULL  19.9,29.6 180 top
H1  106,4 0 top
H2  106,60 0 top
H3  4,60 0 top
H4  4,4 0 top
IC2  17.5,38.8 0 top
J1  107.3,49.15 270 top
MICRO_USB  105.91,33.65 90 top
NET  6.1,16 90 top
PMS  55.91,5.8 0 top
POWER  103.74,11.79 90 top
PWR  6.1,18.1 90 top
R1  6,22.1 180 bottom
R4  57.01,20.6 0 top
R5  103.03,47.44 90 top
R6  6.2,13.7 180 bottom
R7  6,19.6 180 bottom
R14  103.61,14.43 180 top
R16  53.34,20.66 0 top
R17  17.5,33.9 90 top
R19  14.1,34 90 top
R20  20.5,44.4 0 top
RI  6.1,20.9 90 top
S1  42.6,11.2 180 top
SV1  80,44.94 180 top
SV2  80,17 180 top
SW1  87.7,2 0 top
SW2  72.1,2 0 top
TP1  37.3,31.2 0 top
TP2  16,19.3 0 top
U1  29.1,13.1 180 top
U2  13.2,6.3 0 top
U3  92.88,32.87 180 bottom
X1  91.09,60.4 0 top
X2  16.9,33.6 0 bottom
X4  34,0.3 90 top

### Tracks (layer width: path | path; a pad name or v marks a point on that pad's centre or on a via)
1.8V  (via drill 0.35)
  Top 0.3: 38.12,27.4 D3.1
  Top 0.4: D3.1 35.75,27.35
  Top 0.6: U1.16 28.4,22.3 | 35.75,27.35 v35.7,27.4
  Top 1.2: 28.4,22.3 28.4,23.1 31.3,26 34.3,26 v35.7,27.4 37.3,29 TP1.TP
  Bottom 1.2: v35.7,27.4 33.41,29.68 X2.C1
2.8V
  Top 0.3: U1.18 25.4,20.4 25.4,21.3 25.2,21.5 | 16.4,19.3 16.1,19.3 TP2.TP
  Top 0.6: 25.2,21.5 25.1,21.6 22.2,21.6 21.7,22.1 21.4,22.1
  Top 1.2: 16.1,19.3 18.9,22.1 21.7,22.1
+3V3  (1 unrouted)
  Top 0.6: R5.1 | R5.1 104.5,46.6 | 101.6,46.6 R5.1
  Top 1.2: 104.5,46.6 J1.3 | SV1.1 97.78,45.98 98.4,46.6 101.6,46.6
  Bottom 0.4: C8.1 85.8,32.98 | 89.69,32.98 U3.2
  Bottom 0.6: 91.63,32.87 U3.2 88.53,32.87 88.5,32.9 | 87.03,32.87 85.63,32.87 C8.1 83.82,32.98 83.8,33
  Bottom 1.2: U3.4 91.63,32.87 91.6,32.9 | 88.53,32.87 87.03,32.87 87,32.9 | 83.82,32.98 82.18,32.98 80.7,31.5 80.7,28.8 82.2,27.3 96.9,27.3 101.3,31.7 101.3,38.5 97.78,42.02 SV1.1
+5V  (via drill 0.35)  (1 unrouted)
  Top 0.4: 102.51,14.18 R14.2 | 14.51,10.11 U2.14 | v11.9,27.2 10.9,26.2 v5.3,26.2
  Top 0.6: SW1.1 85.45,5.65 85.5,5.7 | R14.2 102.73,14.4 101.1,14.4 | 100.3,35.3 99.23,35.3 C1.1 99.18,36.48 99.2,36.5 | v16,27.4 16.4,27.8 CHRG.A 17.75,28.85 18.4,29.5 18.4,31.02
  Top 1.2: 85.45,5.65 85.45,8.95 87.4,10.9 95.5,10.9 97.9,13.3 | 97.9,13.3 97.9,16.88 SV2.1 97.78,21.78 99.8,23.8 99.8,30.6 102.6,33.4 102.6,34.7 102,35.3 100.3,35.3 | 101.1,14.4 99,14.4 97.9,13.3 | 99.18,36.48 99.18,37.52 97.2,39.5 88.2,39.5 v83.9,35.2 70.3,35.2 v68.1,37.4 | v62.1,36.9 61,35.8 48,35.8 45.3,38.5 v32.8,38.5 | v20.6,34.9 21.3,34.2 21.3,33.1 20.2,32 19.3,32 18.55,31.25 18.55,31.16 18.4,31.02 18.4,30.5 | v16,27.4 15.81,27.4 15.15,26.73 | v13.7,9 v13.7,9.9 13.91,10.11 14.51,10.11 | IC2.4 18.45,41.75 19.5,42.8 20.9,42.8 21.5,42.2 21.5,41.4 20.5,40.4 20.5,39.5 v21.2,38.8
  Bottom 0.4: 89.78,35.2 U3.3 | v5.3,26.2 4.1,26.2 2.2,24.3 2.2,22.9 3,22.1 R1.1
  Bottom 0.6: U3.3 88.13,35.17 88.1,35.2 | X1.8 86.72,57.52 86.7,57.5
  Bottom 1.2: 88.13,35.17 83.93,35.17 v83.9,35.2 | v68.1,37.4 66.6,38.9 64.1,38.9 v62.1,36.9 60.5,35.3 59.4,35.3 55.7,39 55.7,45.3 59.5,49.1 61.2,49.1 69.2,57.1 76,57.1 77.1,56 85.9,56 86.72,56.81 86.72,57.52 | v32.8,38.5 26.1,38.5 25.7,38.9 21.3,38.9 v21.2,38.8 20,37.6 20,35.5 v20.6,34.9 | v11.9,27.2 12.9,27.2 13.4,26.7 v15,26.7 13.7,25.4 v13.7,9.9
DHT_LED  (via drill 0.35)
  Top 0.3: R16.2 54.19,23.69 64.5,34 64.5,39.8 v66,41.3
  Bottom 0.3: v66,41.3 66.4,41.7 70.9,41.7 72.38,43.18 SV1.11
DHT_OUT
  Top 0.3: SV1.6 85.08,47.18 86.3,48.4 102.92,48.4 R5.2 | R5.2 103.14,48.4 | R5.2 103.24,48.5 104.6,48.5 105.25,49.15 J1.2
  Top 0.4: 102.82,48.5 R5.2
ESP_RST
  Top 0.3: SW2.2 72.85,7.65 78.6,13.4 91.5,13.4 92.7,14.6 SV2.3
GND  (via drill 0.35)  (1 unrouted)
  Top 0.3: U1.6 37.8,15.1 38.45,15.1 39.05,15.7 39.2,15.7 40.6,17.1 40.6,19 40.4,19.2 39.3,19.2 38.6,18.5 38.6,18 37.9,17.3 U1.8 | U2.4 9,6.3 v8.6,5.9 | v9,2.9 9.41,2.49 U2.7 | v18.1,4.7 17.77,5.03 U2.10
  Top 0.4: U1.84 24,8.9 U1.67 | U1.58 25.6,18.4 25,17.8 25,16.3 U1.82 | U1.41 35.5,5.9 | D3.2 38.9,26.7 39.2,26.4 39.2,25 v38.9,24.7
  Bottom 0.3: v8.6,5.9 8.6,3.3 v9,2.9 9.2,3.1 16.6,3.1 18.1,4.6 v18.1,4.7
  other vias: 38.4,1 38.4,2.8 38.4,4.3 28.3,1.2 28.4,4.4 39.9,1 76.8,23.7 79.1,23.7 81.8,23.7 84.8,23.7 87.2,23.6 89.3,23.5 91.5,23.5 93.8,23.5 93.9,21.5 91.6,21.6 89.4,21.6 87.3,21.7 85,21.8 82,21.8 79.2,21.8 77,21.8 92.1,30.6 93.6,30.7 95.8,30.1 97.2,30.4 92.1,28.9 94.3,28.9 96.1,29 37.5,24.7 40.1,24.7 44.3,17.1 42.8,18 42.2,20 42.3,21.6 40.7,20 100.1,4.2 98.6,4.2 98.7,2.7 100.1,2.8 60.2,8.5 61.3,8.5 62.4,8.5 63.5,8.5 64.6,8.5 60.2,7.3 61.6,7.3 63.1,7.3 64.6,7.3 36.9,49.3 38.7,49.3 40.7,49.3 42.4,49.3 43.8,49.3 45.2,49.3 46.6,49.3 48.1,49.3 36.9,47.6 38.7,47.6 40.7,47.6 42.4,47.6 43.8,47.6 45.2,47.6 46.6,47.6 48.1,47.6 37,46.1 38.8,46.1 40.7,46.1 42.5,46.1 43.8,46.1 45.2,46.1 46.7,46.1 48.1,46.1 17.7,27.3 17.7,26.1 74.6,50.5 75.9,50.5 77.1,50.5 78.3,50.5 79.5,50.5 80.8,50.5 82.1,50.5 74.7,49 76,49 77.2,49 78.5,49 79.7,49 80.9,49 82.2,49 28.3,2.9 29.6,4.4 29.6,2.8 29.6,1.2 39.9,4.4 39.9,2.8
  pour Top: 0,0 110,0 110,64 0,64
  pour Bottom: 0,0 109.9,0 110,64 0,64
GSM_ANT
  Top 0.7: 34,5 U1.40
  Top 1: X4.P 34,4.4
  Top 1.5: 34,4.4 34,5
GSM_RX
  Top 0.3: D4.2 21.4,3.8 U1.31
GSM_RX_O  (via drill 0.35)
  Top 0.3: v72.1,38.3 75.9,42.1 78.7,42.1 80,43.4 SV1.8 | D4.1 19.6,3.5 20,3.9 20,5.3 19.5,5.8 v19.5,6.5
  Bottom 0.3: v72.1,38.3 72.1,37.7 44.1,9.7 21.8,9.7 21.1,9 21.1,7.6 20.9,7.4 20.4,7.4 v19.5,6.5
GSM_TX
  Top 0.3: U1.32 22.8,2.8 20.8,0.8 9.4,0.8 8.1,2.1 8.1,4 9.13,5.03 U2.5
GSM_TX_5V  (via drill 0.35)
  Top 0.3: U2.6 11.64,3.76 13.9,1.5 17.5,1.5 17.7,1.7 v17.7,1.8 | v75.5,37.6 78.3,40.4 80.6,40.4 82.54,42.34 SV1.7
  Bottom 0.3: v17.7,1.8 22.4,6.5 22.4,7.2 23.9,8.7 44.9,8.7 73.8,37.6 v75.5,37.6
N$4
  Top 0.3: R4.1 56.1,20.54 56.1,16.1 57.5,14.7 57.5,4.5 56.7,3.7 56.1,3.7 55.91,3.89 PMS.A
N$6
  Top 0.3: CHRG.C 16.4,30.5 17.5,31.6 R17.1
N$9
  Top 0.3: IC2.1 16.55,36.75 16.1,36.3 14.7,36.3 14.1,35.7 R19.2 17.4,34.85 R17.2
N$10  (via drill 0.35)
  Top 0.3: v8.1,15.1 8.6,15.6 8.6,16.1 8.4,16.3 7.8,16.3 7.4,15.9 6.95,15.9 NET.A
  Bottom 0.3: R6.2 7.05,14.55 7.6,15.1 v8.1,15.1
N$11  (via drill 0.35)
  Top 0.3: PWR.A 7.4,18.1 8.2,17.3 11.6,17.3 v12,17.7
  Bottom 0.3: R7.2 11.4,19.6 11.7,19.3 11.7,18 v12,17.7
N$12
  Top 0.3: R19.1 14.1,26.3 15.6,24.8 17.8,24.8 18.6,25.6 18.6,27.4 19.2,28 20.8,28 21,28.2 21,30.2 20.85,30.35 FULL.A
N$13
  Top 0.3: R20.1 17.7,44.4 16.5,43.2 16.5,40.15 IC2.5
N$14  (via drill 0.35)
  Top 0.3: v12.2,21 12.1,20.9 RI.A
  Bottom 0.3: R1.2 11.1,22.1 v12.2,21
N$25
  Top 0.3: R14.1 104.46,11.82
  Top 0.4: 104.46,11.82 POWER.A
N$27
  Top 0.3: R16.1 52.49,16.09 51.3,14.9 51.3,4.2 51.6,3.9 52.1,3.9 52.54,4.34 DHT.A
NETSTAT  (via drill 0.35)
  Top 0.13: U1.64 22.35,13.1 21.65,12.4 v19.4,12.4
  Top 0.3: v19.4,12.4 14.4,12.4 12.2,10.2 12.2,9.4 11.6,8.8 10.62,8.8 U2.2
NETSTAT_5V  (via drill 0.35)
  Top 0.3: U2.3 8.43,7.57 5.5,10.5 v5.5,11.6
  Bottom 0.3: v5.5,11.6 5.35,11.75 R6.1
PMS_LED
  Top 0.3: R4.2 57.86,24.36 65.9,32.4 65.9,38.7 68,40.8 68.7,40.8 69.84,41.94 SV1.12
PMS_RX  (via drill 0.35)
  Top 0.3: v88.4,53 90.47,55.06 X1.5
  Bottom 0.3: SV1.13 67.3,48.8 71.5,53 v88.4,53
PMS_TX
  Bottom 0.3: SV1.14 64.76,48.86 70.5,54.6 88.9,54.6 91.72,57.41 X1.4
PWRKEY  (via drill 0.35)
  Top 0.13: U1.48 36.16,13.8 v38.8,13.8
  Top 0.3: S1.2_1 S1.2_2 40.55,13.05 40.4,13.2 39.4,13.2 v38.8,13.8 42.5,13.8 42.8,13.5 44.4,13.5 45,14.1 45,14.8 44.7,15.1 D1.2
PWRSTAT  (via drill 0.35)
  Top 0.3: U1.4 38.7,11.7 v39.1,11.3 | U2.9 14.64,3.76 13.8,4.6 v13.8,5.5
  Bottom 0.3: v39.1,11.3 37.6,12.8 37.6,14.1 33.1,18.6 20,18.6 17.5,16.1 17.5,9.4 16.3,8.2 15.4,8.2 13.8,6.6 v13.8,5.5
PWRSTAT_5V  (via drill 0.35)
  Top 0.3: U2.8 14.91,2.49 12.3,5.1 v12.3,7.5
  Bottom 0.3: v12.3,7.5 10.7,9.1 5.6,9.1 1,13.7 1,19.2 1.4,19.6 R7.1
RI  (via drill 0.35)
  Top 0.13: U1.68 22.04,8.2 v18.9,8.2
  Top 0.3: v18.9,8.2 17.7,8.2 17.07,7.57 U2.12
RI_5V  (via drill 0.35)
  Top 0.3: U2.11 17.5,6.3 v18,6.8 | v18.9,14.5 15.6,17.8 14.4,17.8 13.6,18.6 13.6,22.9 11.8,24.7 5.9,24.7 3.4,22.2 3.4,21.3 3.8,20.9 RI.C
  Bottom 0.3: v18,6.8 18,8.7 18.4,9.1 18.4,14 v18.9,14.5
SIMCLK  (via drill 0.35)
  Top 0.1: U1.55 29.8,18.85
  Top 0.13: 29.8,18.85 30.5,19.55 30.5,21.3 v31.2,22
  Top 0.3: v31.2,22 32.5,23.3 35.7,23.3 36.6,24.2 36.6,25.7 36.95,26.05 D3.3 | v32.5,27.3 34.2,29 v34.2,33.4
  Bottom 0.3: v31.2,22 31.2,26 v32.5,27.3 | v34.2,33.4 32.84,34.77 X2.C3
SIMDATA  (via drill 0.35)
  Top 0.3: U1.14 31.2,20.5 32.9,22.2 40.2,22.2 41.8,23.8 v41.8,24.8 41.8,25.8 41.55,26.05 D3.4
  Bottom 0.3: v41.8,24.8 41.8,33.6 33,42.4 6.6,42.4 1.7,37.5 1.7,35.4 2.33,34.77 X2.C7
SIMRST  (via drill 0.35)
  Top 0.3: U1.15 29.8,22.8 31.7,24.7 v33.7,24.7 | v42.7,26.2 42.2,26.7 D3.5
  Bottom 0.3: X2.C2 32.98,32.23 37,28.2 37,26.9 35.9,25.8 34.8,25.8 v33.7,24.7 35.8,24.7 37.3,23.2 42.2,23.2 43.3,24.3 43.3,25.6 v42.7,26.2
V_LIPO
  Top 0.4: 16.5,50.73 D2.1 | U1.1 36.8,7.1 U1.42
  Top 0.6: 19.5,36.2 19.3,36 18.7,36 18.45,36.25 IC2.3
  Top 1.2: CN1.1 10.8,34 11.9,35.1 11.9,37.3 8.8,40.4 5.5,40.4 1.9,44 1.9,53.4 3,54.5 6.3,54.5 7,53.8 C9.+ 8.65,49.95 C10.1 C11.1 14.25,49.95 15.04,50.73 16.5,50.73 | D2.1 21.16,50.73 25.6,46.3 25.6,40.1 22.1,36.6 | 19.5,36.2 19.9,36.6 22.1,36.6 | U1.1 45.6,7.5 48.2,10.1 48.2,16.3 44.8,19.7 44.8,30.9 39.1,36.6 22.1,36.6
VIN  (via drill 0.35)
  Top 0.4: 88.45,5.55 SW1.2 | MICRO_USB.1 104.45,32.35 104.4,32.3
  Top 1.2: v104.9,20.8 v104.9,21.6 104.9,23.2 102.7,25.4 102.7,31 104,32.3 104.4,32.3 | 88.45,5.55 88.45,6.45 89,7 v98.4,7
  Bottom 1.2: v97.5,7 v98.4,7 99.4,7 104.9,12.5 v104.9,21.6
VRTC  (via drill 0.35)
  Top 0.13: U1.56 27.7,19.3 27.7,20.85 27.2,21.35 v27.2,21.6
  Top 0.3: v27.2,21.6 25.9,22.9 C4.1

### Text on the board
tPlace: POWER | RESET | SWITCH | /Users/kirah/Downloads/Logo-Files-01.bmp
tNames: PMS5003 | DHT22 | 1.8V | 2.8V | ON | OFF